# Altium project Avalon_4_Rev01.PrjPCB (part 2 of 5)
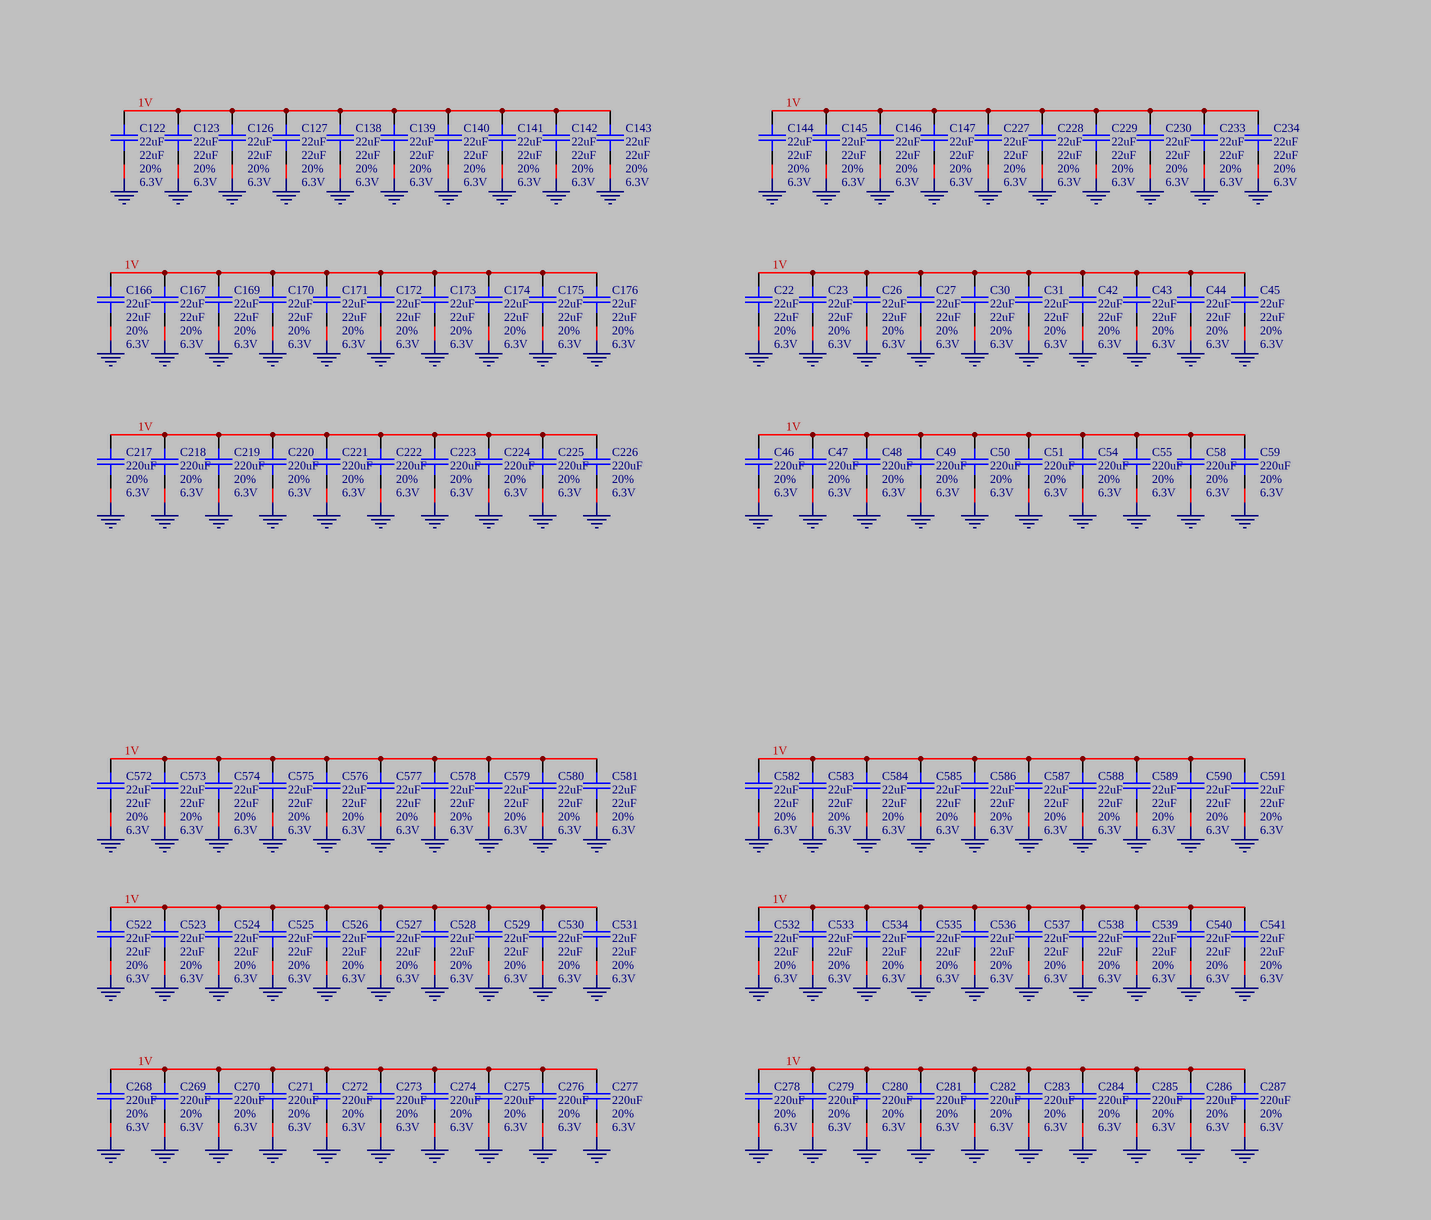
[diagram p11: CPU_Logic.SchDoc, bottom right]

## Sheet CPU_Logic.SchDoc: Title (continued)

### Nets
GND: C19.1 C22.1 C23.1 C26.1 C27.1 C30.1 C31.1 C36.1 C42.1 C43.1 C44.1 C45.1 C46.1 C47.1 C48.1 C49.1 C50.1 C51.1 C54.1 C55.1 C58.1 C59.1 C62.1 C63.1 C74.1 C75.1 C76.1 C77.1 C78.1 C79.1 C80.1 C81.1 C82.1 C83.1 C86.1 C87.1 C90.1 C91.1 C94.1 C95.1 C106.1 C107.1 C108.1 C109.1 C110.1 C111.1 C112.1 C113.1 C114.1 C115.1 C118.1 C119.1 C122.1 C123.1 C126.1 C127.1 C138.1 C139.1 C140.1 C141.1 C142.1 C143.1 C144.1 C145.1 C146.1 C147.1 C148.1 C149.1 C150.1 C151.1 C152.1 C153.1 C154.1 C155.1 C156.1 C157.1 C158.1 C159.1 C160.1 C161.1 C162.1 C163.1 C164.1 C165.1 C166.1 C167.1 C169.1 C170.1 C171.1 C172.1 C173.1 C174.1 C175.1 C176.1 C177.1 C178.1 C179.1 C180.1 C181.1 C182.1 C183.1 C184.1 C185.1 C186.1 C187.1 C188.1 C189.1 C190.1 C191.1 C192.1 C193.1 C194.1 C195.1 C196.1 C197.1 C198.1 C199.1 C200.1 C201.1 C202.1 C203.1 C204.1 C205.1 C206.1 C207.1 C208.1 C209.1 C210.1 C211.1 C212.1 C213.1 C214.1 C215.1 C216.1 C217.1 C218.1 C219.1 C220.1 C221.1 C222.1 C223.1 C224.1 C225.1 C226.1 C227.1 C228.1 C229.1 C230.1 C233.1 C234.1 C235.1 C237.1 C238.1 C239.1 C240.1 C241.1 C242.1 C243.1 C244.1 C245.1 C246.1 C247.1 C248.1 C249.1 C252.1 C253.1 C254.1 C255.1 C256.1 C257.1 C258.1 C259.1 C260.1 C261.1 C262.1 C263.1 C264.1 C265.1 C266.1 C267.1 C268.1 C269.1 C270.1 C271.1 C272.1 C273.1 C274.1 C275.1 C276.1 C277.1 C278.1 C279.1 C280.1 C281.1 C282.1 C283.1 C284.1 C285.1 C286.1 C287.1 C288.1 C289.1 C290.1 C291.1 C292.1 C293.1 C294.1 C295.1 C296.1 C297.1 C298.1 C299.1 C300.1 C301.1 C302.1 C303.1 C304.1 C305.1 C306.1 C307.1 C308.1 C309.1 C310.1 C311.1 C312.1 C313.1 C314.1 C315.1 C316.1 C317.1 C318.1 C319.1 C322.1 C492.1 C493.1 C494.1 C495.1 C496.1 C497.1 C498.1 C499.1 C500.1 C501.1 C502.1 C503.1 C504.1 C505.1 C506.1 C507.1 C508.1 C509.1 C510.1 C511.1 C512.1 C513.1 C514.1 C515.1 C516.1 C517.1 C518.1 C519.1 C520.1 C521.1 C522.1 C523.1 C524.1 C525.1 C526.1 C527.1 C528.1 C529.1 C530.1 C531.1 C532.1 C533.1 C534.1 C535.1 C536.1 C537.1 C538.1 C539.1 C540.1 C541.1 C542.1 C543.1 C544.1 C545.1 C546.1 C547.1 C548.1 C549.1 C550.1 C551.1 C552.1 C553.1 C554.1 C555.1 C556.1 C557.1 C558.1 C559.1 C560.1 C561.1 C562.1 C563.1 C564.1 C565.1 C566.1 C567.1 C568.1 C569.1 C570.1 C571.1 C572.1 C573.1 C574.1 C575.1 C576.1 C577.1 C578.1 C579.1 C580.1 C581.1 C582.1 C583.1 C584.1 C585.1 C586.1 C587.1 C588.1 C589.1 C590.1 C591.1 U1.2(NC) U1.3(NC) U1.4(VSS) U1.11(VSS) U1.12(NC) U1.13(NC) U1.30(TEST) U1.31(NC) U1.32(VSS) U1.39(VSS) U1.40(NC) U1.41(NC) U1.57(EP) U2.2(NC) U2.3(NC) U2.4(VSS) U2.11(VSS) U2.12(NC) U2.13(NC) U2.30(TEST) U2.31(NC) U2.32(VSS) U2.39(VSS) U2.40(NC) U2.41(NC) U2.57(EP) U3.2(NC) U3.3(NC) U3.4(VSS) U3.11(VSS) U3.12(NC) U3.13(NC) U3.30(TEST) U3.31(NC) U3.32(VSS) U3.39(VSS) U3.40(NC) U3.41(NC) U3.57(EP) U4.2(NC) U4.3(NC) U4.4(VSS) U4.11(VSS) U4.12(NC) U4.13(NC) U4.30(TEST) U4.31(NC) U4.32(VSS) U4.39(VSS) U4.40(NC) U4.41(NC) U4.57(EP) U13.2(NC) U13.3(NC) U13.4(VSS) U13.11(VSS) U13.12(NC) U13.13(NC) U13.30(TEST) U13.31(NC) U13.32(VSS) U13.39(VSS) U13.40(NC) U13.41(NC) U13.57(EP) U14.2(NC) U14.3(NC) U14.4(VSS) U14.11(VSS) U14.12(NC) U14.13(NC) U14.30(TEST) U14.31(NC) U14.32(VSS) U14.39(VSS) U14.40(NC) U14.41(NC) U14.57(EP) U17.2(NC) U17.3(NC) U17.4(VSS) U17.11(VSS) U17.12(NC) U17.13(NC) U17.30(TEST) U17.31(NC) U17.32(VSS) U17.39(VSS) U17.40(NC) U17.41(NC) U17.57(EP) U18.2(NC) U18.3(NC) U18.4(VSS) U18.11(VSS) U18.12(NC) U18.13(NC) U18.30(TEST) U18.31(NC) U18.32(VSS) U18.39(VSS) U18.40(NC) U18.41(NC) U18.57(EP) U21.2(NC) U21.3(NC) U21.4(VSS) U21.11(VSS) U21.12(NC) U21.13(NC) U21.30(TEST) U21.31(NC) U21.32(VSS) U21.39(VSS) U21.40(NC) U21.41(NC) U21.57(EP) U22.2(NC) U22.3(NC) U22.4(VSS) U22.11(VSS) U22.12(NC) U22.13(NC) U22.30(TEST) U22.31(NC) U22.32(VSS) U22.39(VSS) U22.40(NC) U22.41(NC) U22.57(EP) U25.2(NC) U25.3(NC) U25.4(VSS) U25.11(VSS) U25.12(NC) U25.13(NC) U25.30(TEST) U25.31(NC) U25.32(VSS) U25.39(VSS) U25.40(NC) U25.41(NC) U25.57(EP) U26.2(NC) U26.3(NC) U26.4(VSS) U26.11(VSS) U26.12(NC) U26.13(NC) U26.30(TEST) U26.31(NC) U26.32(VSS) U26.39(VSS) U26.40(NC) U26.41(NC) U26.57(EP) U30.2(NC) U30.3(NC) U30.4(VSS) U30.11(VSS) U30.12(NC) U30.13(NC) U30.30(TEST) U30.31(NC) U30.32(VSS) U30.39(VSS) U30.40(NC) U30.41(NC) U30.57(EP) U31.2(NC) U31.3(NC) U31.4(VSS) U31.11(VSS) U31.12(NC) U31.13(NC) U31.30(TEST) U31.31(NC) U31.32(VSS) U31.39(VSS) U31.40(NC) U31.41(NC) U31.57(EP) U32.2(NC) U32.3(NC) U32.4(VSS) U32.11(VSS) U32.12(NC) U32.13(NC) U32.30(TEST) U32.31(NC) U32.32(VSS) U32.39(VSS) U32.40(NC) U32.41(NC) U32.57(EP) U33.2(NC) U33.3(NC) U33.4(VSS) U33.11(VSS) U33.12(NC) U33.13(NC) U33.30(TEST) U33.31(NC) U33.32(VSS) U33.39(VSS) U33.40(NC) U33.41(NC) U33.57(EP) YO1.2(GND) YO2.2(GND) YO3.2(GND)
0.9V: C304.2 C305.2 C306.2 C307.2 C308.2 C309.2 C310.2 C311.2 C312.2 C313.2 C314.2 C315.2 C316.2 C317.2 C318.2 C319.2 TP300.1 U1.14(VDDPLL) U1.29(NC) U2.14(VDDPLL) U2.29(NC) U3.14(VDDPLL) U3.29(NC) U4.14(VDDPLL) U4.29(NC) U13.14(VDDPLL) U13.29(NC) U14.14(VDDPLL) U14.29(NC) U17.14(VDDPLL) U17.29(NC) U18.14(VDDPLL) U18.29(NC) U21.14(VDDPLL) U21.29(NC) U22.14(VDDPLL) U22.29(NC) U25.14(VDDPLL) U25.29(NC) U26.14(VDDPLL) U26.29(NC) U30.14(VDDPLL) U30.29(NC) U31.14(VDDPLL) U31.29(NC) U32.14(VDDPLL) U32.29(NC) U33.14(VDDPLL) U33.29(NC) ; port 0.9V
1.8V: C288.2 C289.2 C290.2 C291.2 C292.2 C293.2 C294.2 C295.2 C296.2 C297.2 C298.2 C299.2 C300.2 C301.2 C302.2 C303.2 C322.2 TP84.1 U1.1(VDDIO) U1.42(VDDIO) U2.1(VDDIO) U2.42(VDDIO) U3.1(VDDIO) U3.42(VDDIO) U4.1(VDDIO) U4.42(VDDIO) U13.1(VDDIO) U13.42(VDDIO) U14.1(VDDIO) U14.42(VDDIO) U17.1(VDDIO) U17.42(VDDIO) U18.1(VDDIO) U18.42(VDDIO) U21.1(VDDIO) U21.42(VDDIO) U22.1(VDDIO) U22.42(VDDIO) U25.1(VDDIO) U25.42(VDDIO) U26.1(VDDIO) U26.42(VDDIO) U30.1(VDDIO) U30.42(VDDIO) U31.1(VDDIO) U31.42(VDDIO) U32.1(VDDIO) U32.42(VDDIO) U33.1(VDDIO) U33.42(VDDIO) YO1.1(OE) YO1.4(VDD) YO2.1(OE) YO2.4(VDD) YO3.1(OE) YO3.4(VDD) ; port 1.8V
1V: C19.2 C22.2 C23.2 C26.2 C27.2 C30.2 C31.2 C36.2 C42.2 C43.2 C44.2 C45.2 C46.2 C47.2 C48.2 C49.2 C50.2 C51.2 C54.2 C55.2 C58.2 C59.2 C62.2 C63.2 C74.2 C75.2 C76.2 C77.2 C78.2 C79.2 C80.2 C81.2 C82.2 C83.2 C86.2 C87.2 C90.2 C91.2 C94.2 C95.2 C106.2 C107.2 C108.2 C109.2 C110.2 C111.2 C112.2 C113.2 C114.2 C115.2 C118.2 C119.2 C122.2 C123.2 C126.2 C127.2 C138.2 C139.2 C140.2 C141.2 C142.2 C143.2 C144.2 C145.2 C146.2 C147.2 C148.2 C149.2 C150.2 C151.2 C152.2 C153.2 C154.2 C155.2 C156.2 C157.2 C158.2 C159.2 C160.2 C161.2 C162.2 C163.2 C164.2 C165.2 C166.2 C167.2 C169.2 C170.2 C171.2 C172.2 C173.2 C174.2 C175.2 C176.2 C177.2 C178.2 C179.2 C180.2 C181.2 C182.2 C183.2 C184.2 C185.2 C186.2 C187.2 C188.2 C189.2 C190.2 C191.2 C192.2 C193.2 C194.2 C195.2 C196.2 C197.2 C198.2 C199.2 C200.2 C201.2 C202.2 C203.2 C204.2 C205.2 C206.2 C207.2 C208.2 C209.2 C210.2 C211.2 C212.2 C213.2 C214.2 C215.2 C216.2 C217.2 C218.2 C219.2 C220.2 C221.2 C222.2 C223.2 C224.2 C225.2 C226.2 C227.2 C228.2 C229.2 C230.2 C233.2 C234.2 C235.2 C237.2 C238.2 C239.2 C240.2 C241.2 C242.2 C243.2 C244.2 C245.2 C246.2 C247.2 C248.2 C249.2 C252.2 C253.2 C254.2 C255.2 C256.2 C257.2 C258.2 C259.2 C260.2 C261.2 C262.2 C263.2 C264.2 C265.2 C266.2 C267.2 C268.2 C269.2 C270.2 C271.2 C272.2 C273.2 C274.2 C275.2 C276.2 C277.2 C278.2 C279.2 C280.2 C281.2 C282.2 C283.2 C284.2 C285.2 C286.2 C287.2 C492.2 C493.2 C494.2 C495.2 C496.2 C497.2 C498.2 C499.2 C500.2 C501.2 C502.2 C503.2 C504.2 C505.2 C506.2 C507.2 C508.2 C509.2 C510.2 C511.2 C512.2 C513.2 C514.2 C515.2 C516.2 C517.2 C518.2 C519.2 C520.2 C521.2 C522.2 C523.2 C524.2 C525.2 C526.2 C527.2 C528.2 C529.2 C530.2 C531.2 C532.2 C533.2 C534.2 C535.2 C536.2 C537.2 C538.2 C539.2 C540.2 C541.2 C542.2 C543.2 C544.2 C545.2 C546.2 C547.2 C548.2 C549.2 C550.2 C551.2 C552.2 C553.2 C554.2 C555.2 C556.2 C557.2 C558.2 C559.2 C560.2 C561.2 C562.2 C563.2 C564.2 C565.2 C566.2 C567.2 C568.2 C569.2 C570.2 C571.2 C572.2 C573.2 C574.2 C575.2 C576.2 C577.2 C578.2 C579.2 C580.2 C581.2 C582.2 C583.2 C584.2 C585.2 C586.2 C587.2 C588.2 C589.2 C590.2 C591.2 U1.15(VDD) U1.16(VDD) U1.17(VDD) U1.18(VDD) U1.19(VDD) U1.20(VDD) U1.21(VDD) U1.22(VDD) U1.23(VDD) U1.24(VDD) U1.25(VDD) U1.26(VDD) U1.27(VDD) U1.28(VDD) U1.43(VDD) U1.44(VDD) U1.45(VDD) U1.46(VDD) U1.47(VDD) U1.48(VDD) U1.49(VDD) U1.50(VDD) U1.51(VDD) U1.52(VDD) U1.53(VDD) U1.54(VDD) U1.55(VDD) U1.56(VDD) U2.15(VDD) U2.16(VDD) U2.17(VDD) U2.18(VDD) U2.19(VDD) U2.20(VDD) U2.21(VDD) U2.22(VDD) U2.23(VDD) U2.24(VDD) U2.25(VDD) U2.26(VDD) U2.27(VDD) U2.28(VDD) U2.43(VDD) U2.44(VDD) U2.45(VDD) U2.46(VDD) U2.47(VDD) U2.48(VDD) U2.49(VDD) U2.50(VDD) U2.51(VDD) U2.52(VDD) U2.53(VDD) U2.54(VDD) U2.55(VDD) U2.56(VDD) U3.15(VDD) U3.16(VDD) U3.17(VDD) U3.18(VDD) U3.19(VDD) U3.20(VDD) U3.21(VDD) U3.22(VDD) U3.23(VDD) U3.24(VDD) U3.25(VDD) U3.26(VDD) U3.27(VDD) U3.28(VDD) U3.43(VDD) U3.44(VDD) U3.45(VDD) U3.46(VDD) U3.47(VDD) U3.48(VDD) U3.49(VDD) U3.50(VDD) U3.51(VDD) U3.52(VDD) U3.53(VDD) U3.54(VDD) U3.55(VDD) U3.56(VDD) U4.15(VDD) U4.16(VDD) U4.17(VDD) U4.18(VDD) U4.19(VDD) U4.20(VDD) U4.21(VDD) U4.22(VDD) U4.23(VDD) U4.24(VDD) U4.25(VDD) U4.26(VDD) U4.27(VDD) U4.28(VDD) U4.43(VDD) U4.44(VDD) U4.45(VDD) U4.46(VDD) U4.47(VDD) U4.48(VDD) U4.49(VDD) U4.50(VDD) U4.51(VDD) U4.52(VDD) U4.53(VDD) U4.54(VDD) U4.55(VDD) U4.56(VDD) U13.15(VDD) U13.16(VDD) U13.17(VDD) U13.18(VDD) U13.19(VDD) U13.20(VDD) U13.21(VDD) U13.22(VDD) U13.23(VDD) U13.24(VDD) U13.25(VDD) U13.26(VDD) U13.27(VDD) U13.28(VDD) U13.43(VDD) U13.44(VDD) U13.45(VDD) U13.46(VDD) U13.47(VDD) U13.48(VDD) U13.49(VDD) U13.50(VDD) U13.51(VDD) U13.52(VDD) U13.53(VDD) U13.54(VDD) U13.55(VDD) U13.56(VDD) U14.15(VDD) U14.16(VDD) U14.17(VDD) U14.18(VDD) U14.19(VDD) U14.20(VDD) U14.21(VDD) U14.22(VDD) U14.23(VDD) U14.24(VDD) U14.25(VDD) U14.26(VDD) U14.27(VDD) U14.28(VDD) U14.43(VDD) U14.44(VDD) U14.45(VDD) U14.46(VDD) U14.47(VDD) U14.48(VDD) U14.49(VDD) U14.50(VDD) U14.51(VDD) U14.52(VDD) U14.53(VDD) U14.54(VDD) U14.55(VDD) U14.56(VDD) U17.15(VDD) U17.16(VDD) U17.17(VDD) U17.18(VDD) U17.19(VDD) U17.20(VDD) U17.21(VDD) U17.22(VDD) U17.23(VDD) U17.24(VDD) U17.25(VDD) U17.26(VDD) U17.27(VDD) U17.28(VDD) U17.43(VDD) U17.44(VDD) U17.45(VDD) U17.46(VDD) U17.47(VDD) U17.48(VDD) U17.49(VDD) U17.50(VDD) U17.51(VDD) U17.52(VDD) U17.53(VDD) U17.54(VDD) U17.55(VDD) U17.56(VDD) U18.15(VDD) U18.16(VDD) U18.17(VDD) U18.18(VDD) U18.19(VDD) U18.20(VDD) U18.21(VDD) U18.22(VDD) U18.23(VDD) U18.24(VDD) U18.25(VDD) U18.26(VDD) U18.27(VDD) U18.28(VDD) U18.43(VDD) U18.44(VDD) U18.45(VDD) U18.46(VDD) U18.47(VDD) U18.48(VDD) U18.49(VDD) U18.50(VDD) U18.51(VDD) U18.52(VDD) U18.53(VDD) U18.54(VDD) U18.55(VDD) U18.56(VDD) U21.15(VDD) U21.16(VDD) U21.17(VDD) U21.18(VDD) U21.19(VDD) U21.20(VDD) U21.21(VDD) U21.22(VDD) U21.23(VDD) U21.24(VDD) U21.25(VDD) U21.26(VDD) U21.27(VDD) U21.28(VDD) U21.43(VDD) U21.44(VDD) U21.45(VDD) U21.46(VDD) U21.47(VDD) U21.48(VDD) U21.49(VDD) U21.50(VDD) U21.51(VDD) U21.52(VDD) U21.53(VDD) U21.54(VDD) U21.55(VDD) U21.56(VDD) U22.15(VDD) U22.16(VDD) U22.17(VDD) U22.18(VDD) U22.19(VDD) U22.20(VDD) U22.21(VDD) U22.22(VDD) U22.23(VDD) U22.24(VDD) U22.25(VDD) U22.26(VDD) U22.27(VDD) U22.28(VDD) U22.43(VDD) U22.44(VDD) U22.45(VDD) U22.46(VDD) U22.47(VDD) U22.48(VDD) U22.49(VDD) U22.50(VDD) U22.51(VDD) U22.52(VDD) U22.53(VDD) U22.54(VDD) U22.55(VDD) U22.56(VDD) U25.15(VDD) U25.16(VDD) U25.17(VDD) U25.18(VDD) U25.19(VDD) U25.20(VDD) U25.21(VDD) U25.22(VDD) U25.23(VDD) U25.24(VDD) U25.25(VDD) U25.26(VDD) U25.27(VDD) U25.28(VDD) U25.43(VDD) U25.44(VDD) U25.45(VDD) U25.46(VDD) U25.47(VDD) U25.48(VDD) U25.49(VDD) U25.50(VDD) U25.51(VDD) U25.52(VDD) U25.53(VDD) U25.54(VDD) U25.55(VDD) U25.56(VDD) U26.15(VDD) U26.16(VDD) U26.17(VDD) U26.18(VDD) U26.19(VDD) U26.20(VDD) U26.21(VDD) U26.22(VDD) U26.23(VDD) U26.24(VDD) U26.25(VDD) U26.26(VDD) U26.27(VDD) U26.28(VDD) U26.43(VDD) U26.44(VDD) U26.45(VDD) U26.46(VDD) U26.47(VDD) U26.48(VDD) U26.49(VDD) U26.50(VDD) U26.51(VDD) U26.52(VDD) U26.53(VDD) U26.54(VDD) U26.55(VDD) U26.56(VDD) U30.15(VDD) U30.16(VDD) U30.17(VDD) U30.18(VDD) U30.19(VDD) U30.20(VDD) U30.21(VDD) U30.22(VDD) U30.23(VDD) U30.24(VDD) U30.25(VDD) U30.26(VDD) U30.27(VDD) U30.28(VDD) U30.43(VDD) U30.44(VDD) U30.45(VDD) U30.46(VDD) U30.47(VDD) U30.48(VDD) U30.49(VDD) U30.50(VDD) U30.51(VDD) U30.52(VDD) U30.53(VDD) U30.54(VDD) U30.55(VDD) U30.56(VDD) U31.15(VDD) U31.16(VDD) U31.17(VDD) U31.18(VDD) U31.19(VDD) U31.20(VDD) U31.21(VDD) U31.22(VDD) U31.23(VDD) U31.24(VDD) U31.25(VDD) U31.26(VDD) U31.27(VDD) U31.28(VDD) U31.43(VDD) U31.44(VDD) U31.45(VDD) U31.46(VDD) U31.47(VDD) U31.48(VDD) U31.49(VDD) U31.50(VDD) U31.51(VDD) U31.52(VDD) U31.53(VDD) U31.54(VDD) U31.55(VDD) U31.56(VDD) U32.15(VDD) U32.16(VDD) U32.17(VDD) U32.18(VDD) U32.19(VDD) U32.20(VDD) U32.21(VDD) U32.22(VDD) U32.23(VDD) U32.24(VDD) U32.25(VDD) U32.26(VDD) U32.27(VDD) U32.28(VDD) U32.43(VDD) U32.44(VDD) U32.45(VDD) U32.46(VDD) U32.47(VDD) U32.48(VDD) U32.49(VDD) U32.50(VDD) U32.51(VDD) U32.52(VDD) U32.53(VDD) U32.54(VDD) U32.55(VDD) U32.56(VDD) U33.15(VDD) U33.16(VDD) U33.17(VDD) U33.18(VDD) U33.19(VDD) U33.20(VDD) U33.21(VDD) U33.22(VDD) U33.23(VDD) U33.24(VDD) U33.25(VDD) U33.26(VDD) U33.27(VDD) U33.28(VDD) U33.43(VDD) U33.44(VDD) U33.45(VDD) U33.46(VDD) U33.47(VDD) U33.48(VDD) U33.49(VDD) U33.50(VDD) U33.51(VDD) U33.52(VDD) U33.53(VDD) U33.54(VDD) U33.55(VDD) U33.56(VDD) ; port 1V
LOAD: TP117.1 U1.5(LOAD) ; port LOAD
LOADOUT: TP230.1 U18.38(LOADOUT) U21.5(LOAD)
MISO: TP134.1 U1.7(MISO) ; port MISO
MISOIN: R3.1 TP245.1 U18.36(MISOIN) U21.7(MISO)
MOSI: TP135.1 U1.8(MOSI) ; port MOSI
MOSIOUT: R3.2 TP246.1 U18.35(MOSIOUT) U21.8(MOSI)
RSTN: TP121.1 U1.6(RSTN) ; port RSTN
RSTNOUT: TP238.1 U18.37(RSTNOUT) U21.6(RSTN)
SCK: TP143.1 U1.9(SCK) ; port SCK
SCKOUT: TP262.1 U18.34(SCKOUT) U21.9(SCK)
XCLKIN: TP151.1 U1.10(XCLKIN) YO1.3(OSC) YO2.3(OSC) YO3.3(OSC) ; port XCLKIN
XCLKOUT: TP278.1 U18.33(XCLKOUT) U21.10(XCLKIN)
NetR19_1: R19.1 U33.36(MISOIN)
NetR19_2: R19.2 U33.35(MOSIOUT)
NetTP3_1: TP3.1 U33.38(LOADOUT)
NetTP15_1: TP15.1 U1.38(LOADOUT) U2.5(LOAD)
NetTP16_1: TP16.1 U1.37(RSTNOUT) U2.6(RSTN)
NetTP17_1: TP17.1 U1.36(MISOIN) U2.7(MISO)
NetTP26_1: TP26.1 U1.35(MOSIOUT) U2.8(MOSI)
NetTP27_1: TP27.1 U1.34(SCKOUT) U2.9(SCK)
NetTP39_1: TP39.1 U2.38(LOADOUT) U3.5(LOAD)
NetTP40_1: TP40.1 U2.37(RSTNOUT) U3.6(RSTN)
NetTP41_1: TP41.1 U2.36(MISOIN) U3.7(MISO)
NetTP42_1: TP42.1 U2.35(MOSIOUT) U3.8(MOSI)
NetTP43_1: TP43.1 U2.34(SCKOUT) U3.9(SCK)
NetTP44_1: TP44.1 U2.33(XCLKOUT) U3.10(XCLKIN)
NetTP56_1: TP56.1 U3.38(LOADOUT) U4.5(LOAD)
NetTP57_1: TP57.1 U3.37(RSTNOUT) U4.6(RSTN)
NetTP58_1: TP58.1 U3.36(MISOIN) U4.7(MISO)
NetTP59_1: TP59.1 U3.35(MOSIOUT) U4.8(MOSI)
NetTP60_1: TP60.1 U3.34(SCKOUT) U4.9(SCK)
NetTP61_1: TP61.1 U3.33(XCLKOUT) U4.10(XCLKIN)
NetTP73_1: TP73.1 U4.38(LOADOUT) U13.5(LOAD)
NetTP74_1: TP74.1 U4.37(RSTNOUT) U13.6(RSTN)
NetTP75_1: TP75.1 U4.36(MISOIN) U13.7(MISO)
NetTP76_1: TP76.1 U4.35(MOSIOUT) U13.8(MOSI)
NetTP77_1: TP77.1 U4.34(SCKOUT) U13.9(SCK)
NetTP78_1: TP78.1 U4.33(XCLKOUT) U13.10(XCLKIN)
NetTP105_1: TP105.1 U13.38(LOADOUT) U14.5(LOAD)
NetTP106_1: TP106.1 U14.38(LOADOUT) U17.5(LOAD)
NetTP107_1: TP107.1 U17.38(LOADOUT) U18.5(LOAD)
NetTP108_1: TP108.1 U13.37(RSTNOUT) U14.6(RSTN)
NetTP109_1: TP109.1 U14.37(RSTNOUT) U17.6(RSTN)
NetTP110_1: TP110.1 U17.37(RSTNOUT) U18.6(RSTN)
NetTP111_1: TP111.1 U13.36(MISOIN) U14.7(MISO)
NetTP112_1: TP112.1 U14.36(MISOIN) U17.7(MISO)
NetTP113_1: TP113.1 U17.36(MISOIN) U18.7(MISO)
NetTP114_1: TP114.1 U13.35(MOSIOUT) U14.8(MOSI)
NetTP115_1: TP115.1 U14.35(MOSIOUT) U17.8(MOSI)
NetTP116_1: TP116.1 U17.35(MOSIOUT) U18.8(MOSI)
NetTP118_1: TP118.1 U13.34(SCKOUT) U14.9(SCK)
NetTP119_1: TP119.1 U14.34(SCKOUT) U17.9(SCK)
NetTP120_1: TP120.1 U17.34(SCKOUT) U18.9(SCK)
NetTP122_1: TP122.1 U13.33(XCLKOUT) U14.10(XCLKIN)
NetTP130_1: TP130.1 U14.33(XCLKOUT) U17.10(XCLKIN)
NetTP133_1: TP133.1 U17.33(XCLKOUT) U18.10(XCLKIN)
NetTP153_1: TP153.1 U1.33(XCLKOUT) U2.10(XCLKIN)
NetTP202_1: TP202.1 U21.38(LOADOUT) U22.5(LOAD)
NetTP203_1: TP203.1 U22.38(LOADOUT) U25.5(LOAD)
NetTP204_1: TP204.1 U25.38(LOADOUT) U26.5(LOAD)
NetTP205_1: TP205.1 U26.38(LOADOUT) U30.5(LOAD)
NetTP206_1: TP206.1 U30.38(LOADOUT) U31.5(LOAD)
NetTP207_1: TP207.1 U31.38(LOADOUT) U32.5(LOAD)
NetTP208_1: TP208.1 U32.38(LOADOUT) U33.5(LOAD)
NetTP209_1: TP209.1 U21.37(RSTNOUT) U22.6(RSTN)
NetTP210_1: TP210.1 U22.37(RSTNOUT) U25.6(RSTN)
NetTP211_1: TP211.1 U25.37(RSTNOUT) U26.6(RSTN)
NetTP212_1: TP212.1 U26.37(RSTNOUT) U30.6(RSTN)
NetTP213_1: TP213.1 U30.37(RSTNOUT) U31.6(RSTN)
NetTP214_1: TP214.1 U31.37(RSTNOUT) U32.6(RSTN)
NetTP215_1: TP215.1 U32.37(RSTNOUT) U33.6(RSTN)
NetTP216_1: TP216.1 U21.36(MISOIN) U22.7(MISO)
NetTP217_1: TP217.1 U22.36(MISOIN) U25.7(MISO)
NetTP218_1: TP218.1 U25.36(MISOIN) U26.7(MISO)
NetTP219_1: TP219.1 U26.36(MISOIN) U30.7(MISO)
NetTP220_1: TP220.1 U30.36(MISOIN) U31.7(MISO)
NetTP221_1: TP221.1 U31.36(MISOIN) U32.7(MISO)
NetTP222_1: TP222.1 U32.36(MISOIN) U33.7(MISO)
NetTP223_1: TP223.1 U21.35(MOSIOUT) U22.8(MOSI)
NetTP224_1: TP224.1 U22.35(MOSIOUT) U25.8(MOSI)
NetTP225_1: TP225.1 U25.35(MOSIOUT) U26.8(MOSI)
NetTP226_1: TP226.1 U26.35(MOSIOUT) U30.8(MOSI)
NetTP227_1: TP227.1 U30.35(MOSIOUT) U31.8(MOSI)
NetTP228_1: TP228.1 U31.35(MOSIOUT) U32.8(MOSI)
NetTP229_1: TP229.1 U32.35(MOSIOUT) U33.8(MOSI)
NetTP231_1: TP231.1 U21.34(SCKOUT) U22.9(SCK)
NetTP232_1: TP232.1 U22.34(SCKOUT) U25.9(SCK)
NetTP233_1: TP233.1 U25.34(SCKOUT) U26.9(SCK)
NetTP234_1: TP234.1 U26.34(SCKOUT) U30.9(SCK)
NetTP235_1: TP235.1 U30.34(SCKOUT) U31.9(SCK)
NetTP236_1: TP236.1 U31.34(SCKOUT) U32.9(SCK)
NetTP237_1: TP237.1 U32.34(SCKOUT) U33.9(SCK)
NetTP239_1: TP239.1 U22.33(XCLKOUT) U25.10(XCLKIN)
NetTP240_1: TP240.1 U25.33(XCLKOUT) U26.10(XCLKIN)
NetTP241_1: TP241.1 U26.33(XCLKOUT) U30.10(XCLKIN)
NetTP242_1: TP242.1 U30.33(XCLKOUT) U31.10(XCLKIN)
NetTP243_1: TP243.1 U31.33(XCLKOUT) U32.10(XCLKIN)
NetTP244_1: TP244.1 U32.33(XCLKOUT) U33.10(XCLKIN)
NetTP295_1: TP295.1 U33.37(RSTNOUT)
NetTP296_1: TP296.1 U33.34(SCKOUT)
NetTP297_1: TP297.1 U33.33(XCLKOUT)
NetTP304_1: TP304.1 U21.33(XCLKOUT) U22.10(XCLKIN)

### Notes on the sheet
- (near R3) Optional

### Library data of the parts
C19 C22 C23 C26 C27 C30 C31 C36 C42-C45 C62 C63 C74-C83 C86 C87 C90 C91 C94 C95 C106-C115 C118 C119 C122 C123 C126 C127 C138-C155 C166 C167 C169-C196 C227-C230 C233 C234 C492-C591 = CAP000043686: DB_PART_TYPE: Ceramic_SMD\Standard_X5R; DB_MANUFACTURER_PART: KEMET    C0805C226M9PAC; NOTE: <NOTE>; DB_T_RANGE: -55 to 85; DB_PACKAGE: 0805; DB_DESCRIPTION: C X5R 22uF 20% 6.3V 0805; DB_CERTIFIED: ISHIDDEN=T; DB_APPROVED_ON: 09.10.2010 г.; DB_STATUS: NEW; DB_PART_NUMBER: CAP000043686; DB_VALUE: 22uF; DB_PCB_DEVICE: SMD_0805_CAPC2012X145N; DB_PRICE: ISHIDDEN=T; DB_LEADTIME: ISHIDDEN=T; DB_MOQ: ISHIDDEN=T; DB_PRICE_DATE: ISHIDDEN=T; DB_APPROVED_BY: ISHIDDEN=T; DB_DATASHEET: http://john.epiqdesign.com/projects/CIS_Datasheets/F3102_CE_Kemet.pdf?rev=92&sc=0
C46-C51 C54 C55 C58 C59 C156-C165 C197-C226 C235 C237-C249 C252-C287 = CAP000047355: DB_PART_TYPE: Ceramic_SMD\Standard_X5R; DB_MANUFACTURER_PART: SAMSUNG    CL32A227MQVNNNE; NOTE: <NOTE>; DB_T_RANGE: -55 to 85; DB_PACKAGE: 1210; DB_DESCRIPTION: C X5R 220uF 20% 6.3V 1210; DB_CERTIFIED: ISHIDDEN=T; DB_APPROVED_BY: VSN; DB_APPROVED_ON: 07.5.2014 г. 11:28:08; DB_STATUS: NEW; DB_PART_NUMBER: CAP000047355; DB_VALUE: 220uF; DB_PCB_DEVICE: SMD_1210_CAPC3225X279N; DB_DATASHEET: http://john.epiqdesign.com/projects/CIS_Datasheets/CAP_CL32A227MQVNNNE.pdf?rev=1401&sc=0
C288-C319 = CAP000027236: DB_PART_TYPE: Ceramic_SMD\Standard_X7R; DB_MANUFACTURER_PART: KEMET    C0603C104M4RAC; NOTE: <NOTE>; DB_T_RANGE: -55 to 125; DB_PACKAGE: 0603; DB_DESCRIPTION: C X7R 100nF 20% 16V 0603; DB_CERTIFIED: ISHIDDEN=T; DB_APPROVED_ON: 09.10.2010 г.; DB_STATUS: NEW; DB_PART_NUMBER: CAP000027236; DB_VALUE: 100nF; DB_PCB_DEVICE: SMD_0603_CAPC1608X95N; DB_PRICE: ISHIDDEN=T; DB_LEADTIME: ISHIDDEN=T; DB_MOQ: ISHIDDEN=T; DB_PRICE_DATE: ISHIDDEN=T; DB_APPROVED_BY: ISHIDDEN=T; DB_DATASHEET: http://john.epiqdesign.com/projects/CIS_Datasheets/F3102_CE_Kemet.pdf?rev=92&sc=0
C322 = CAP000028169: DB_PART_TYPE: Ceramic_SMD\Standard_X7R; DB_MANUFACTURER_PART: KEMET    C0603C474J4RAC; NOTE: <NOTE>; DB_T_RANGE: -55 to 125; DB_PACKAGE: 0603; DB_DESCRIPTION: C X7R 470nF 5% 16V 0603; DB_CERTIFIED: ISHIDDEN=T; DB_APPROVED_ON: 09.10.2010 г.; DB_STATUS: NEW; DB_PART_NUMBER: CAP000028169; DB_VALUE: 470nF; DB_PCB_DEVICE: SMD_0603_CAPC1608X95N; DB_PRICE: ISHIDDEN=T; DB_LEADTIME: ISHIDDEN=T; DB_MOQ: ISHIDDEN=T; DB_PRICE_DATE: ISHIDDEN=T; DB_APPROVED_BY: ISHIDDEN=T; DB_DATASHEET: http://john.epiqdesign.com/projects/CIS_Datasheets/F3102_CE_Kemet.pdf?rev=92&sc=0
R3 R19 = RES000006398: DB_PART_TYPE: SMD; DB_MANUFACTURER_PART: YAGEO    RC0603JR-07100R; NOTE: <NOTE>; DB_T_RANGE: -55 to 155; DB_POWER: 1/10W; DB_PACKAGE: 0603; DB_DESCRIPTION: R SMD 100R 5% 1/10W 0603; DB_CERTIFIED: ISHIDDEN=T; DB_PRICE: 0.000364; DB_MOQ: 5000; DB_APPROVED_ON: 09.10.2010 г.; DB_STATUS: NEW; R_BDS: R; DB_PART_NUMBER: RES000006398; DB_VALUE: 100R; DB_PCB_DEVICE: SMD_0603_RESC1608X55N; DB_PRICE_DATE: 2010-12-23; DB_APPROVED_BY: ISHIDDEN=T; DB_DATASHEET: http://john.epiqdesign.com/projects/CIS_Datasheets/PYu-RC0603_51_RoHS_L_4_YAGEO.pdf?rev=138&sc=0
  R3: Assembly: N/A
TP3 TP15-TP17 TP26 TP27 TP39-TP44 TP56-TP61 TP73-TP78 TP84 TP105-TP122 TP130 TP133-TP135 TP143 TP151 TP153 TP202-TP246 TP262 TP278 TP295-TP297 TP300 TP304 = TPO000000001: DB_PART_TYPE: Test Point; DB_PACKAGE: ISHIDDEN=T; DB_DESCRIPTION: Test Point 100_254; DB_APPROVED_ON: 10.9.2010 г.; DB_STATUS: NEW; DB_PART_NUMBER: TPO000000001; DB_VALUE: 100_254; DB_DIAMETER: 100_254; DB_PCB_DEVICE: SMD_TP_100-254; DB_MANUFACTURER_PART: ISHIDDEN=T; DB_CERTIFIED: ISHIDDEN=T; DB_PRICE: ISHIDDEN=T; DB_LEADTIME: ISHIDDEN=T; DB_MOQ: ISHIDDEN=T; DB_PRICE_DATE: ISHIDDEN=T; DB_APPROVED_BY: ISHIDDEN=T; DB_DATASHEET: ISHIDDEN=T
YO1-YO3 = XTAL_OE1GND2OSC3VDD4: NOTE: <NOTE>
  YO1: DB_PCB_DEVICE: SMD_OSCCF320X400X90-4N
  YO2: DB_PCB_DEVICE: SMD_OSCCF250X320X90-4N
  YO3: DB_PCB_DEVICE: SMD_OSCCF200X250X90-4N
U1-U4 U13 U14 U17 U18 U21 U22 U25 U26 U30-U33 = IC_A3222Q56: DB_PCB_DEVICE: SMD_QFN50P800X800X80-57N